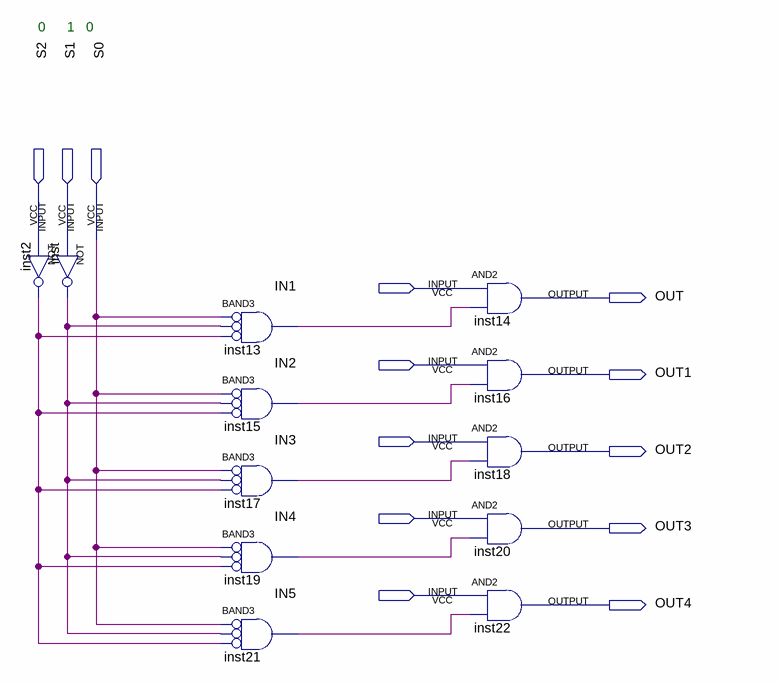
[diagram p0: schematic sheet]
// Quartus schematic DecoderMaiorQue.bdf as structural Verilog: 12 symbols, 13 pins
module DecoderMaiorQue (
  input  S2,
  input  S1,
  input  S0,
  input  IN1,
  input  IN2,
  input  IN3,
  input  IN4,
  input  IN5,
  output OUT,
  output OUT1,
  output OUT2,
  output OUT3,
  output OUT4
);

  wire inst2_out, inst13_out, inst15_out, inst17_out, inst19_out, inst21_out, inst_out;

  not inst (inst_out, S1);
  not inst2 (inst2_out, S2);
  and inst13 (inst13_out, ~S0, ~inst_out, ~inst2_out);  // BAND3
  and inst15 (inst15_out, ~S0, ~inst_out, ~inst2_out);  // BAND3
  and inst17 (inst17_out, ~S0, ~inst_out, ~inst2_out);  // BAND3
  and inst19 (inst19_out, ~S0, ~inst_out, ~inst2_out);  // BAND3
  and inst21 (inst21_out, ~S0, ~inst_out, ~inst2_out);  // BAND3
  and inst14 (OUT, IN1, inst13_out);
  and inst16 (OUT1, IN2, inst15_out);
  and inst18 (OUT2, IN3, inst17_out);
  and inst20 (OUT3, IN4, inst19_out);
  and inst22 (OUT4, IN5, inst21_out);

  // Notes on the sheet:
  //   0
  //   1
  //   0
endmodule
